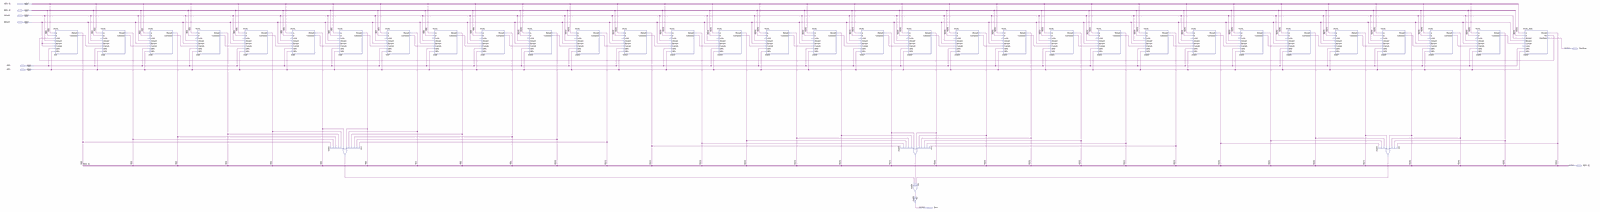
[diagram p0: schematic sheet, whole]
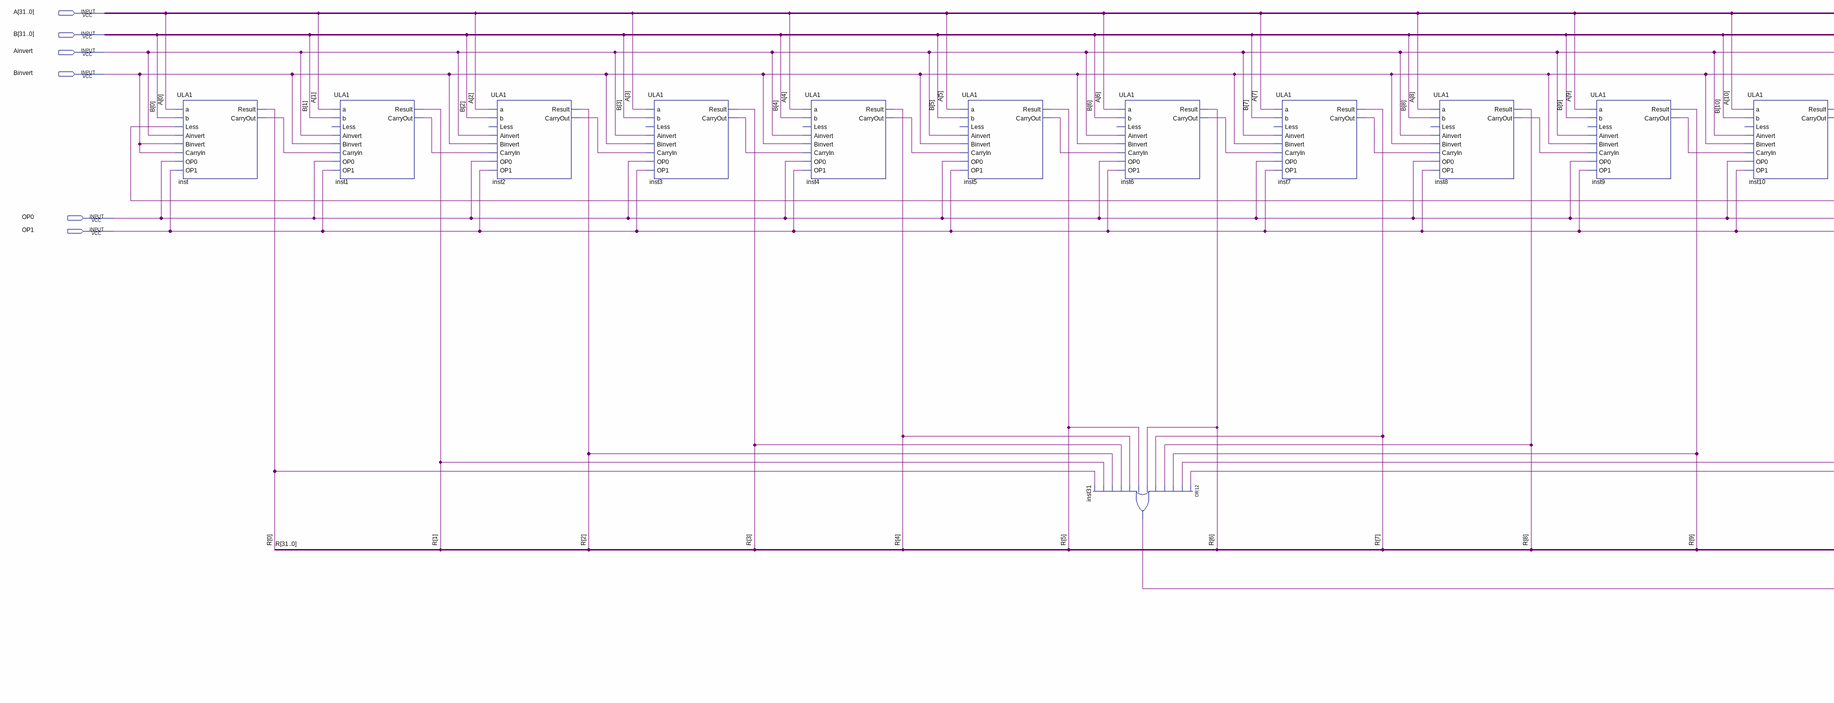
[diagram p1: schematic sheet, left part]
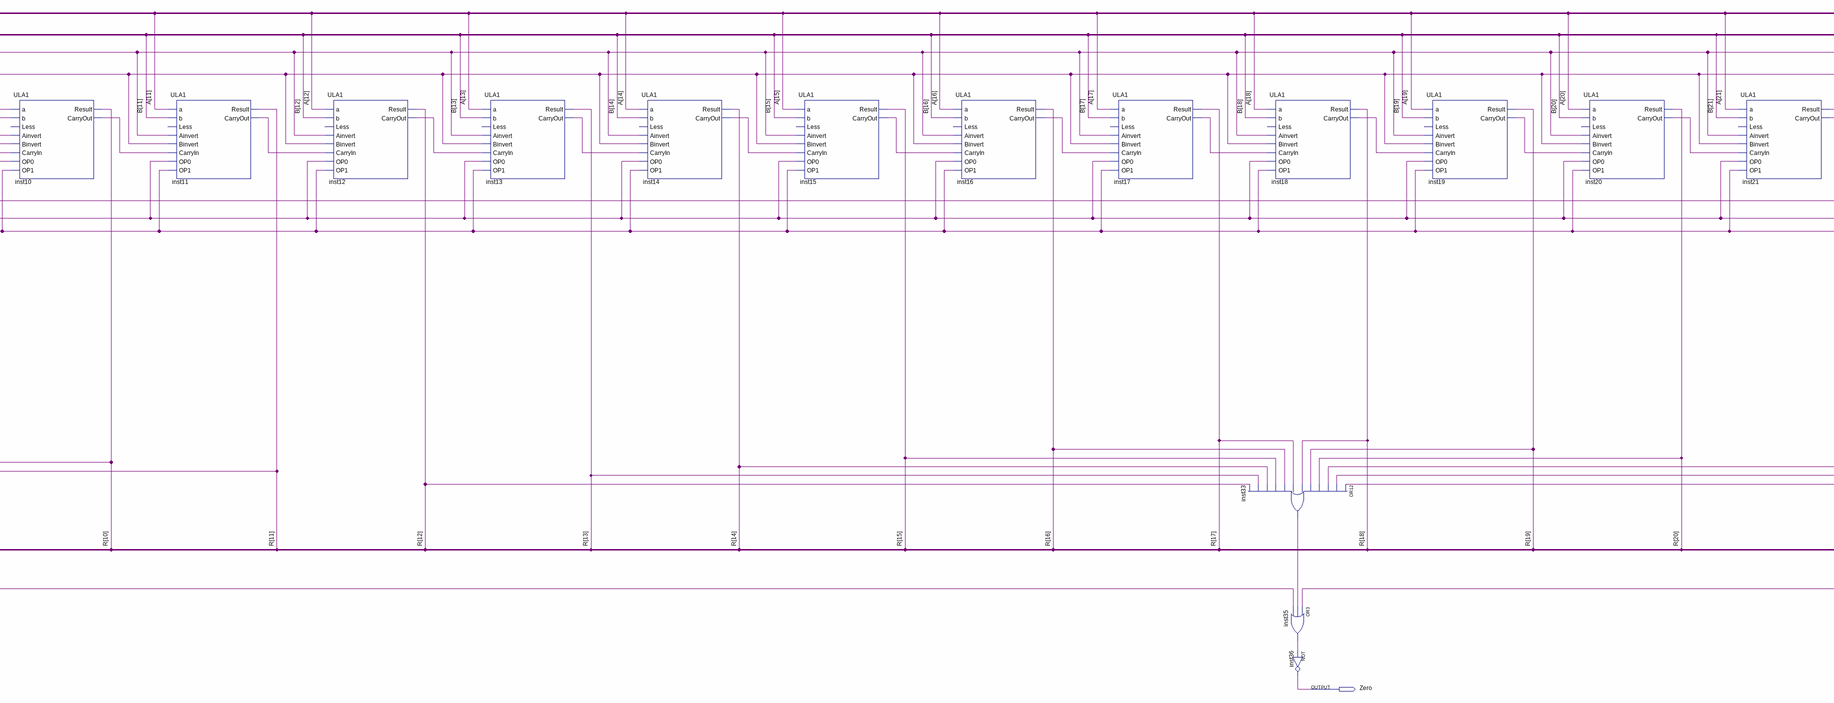
[diagram p2: schematic sheet, centre part]
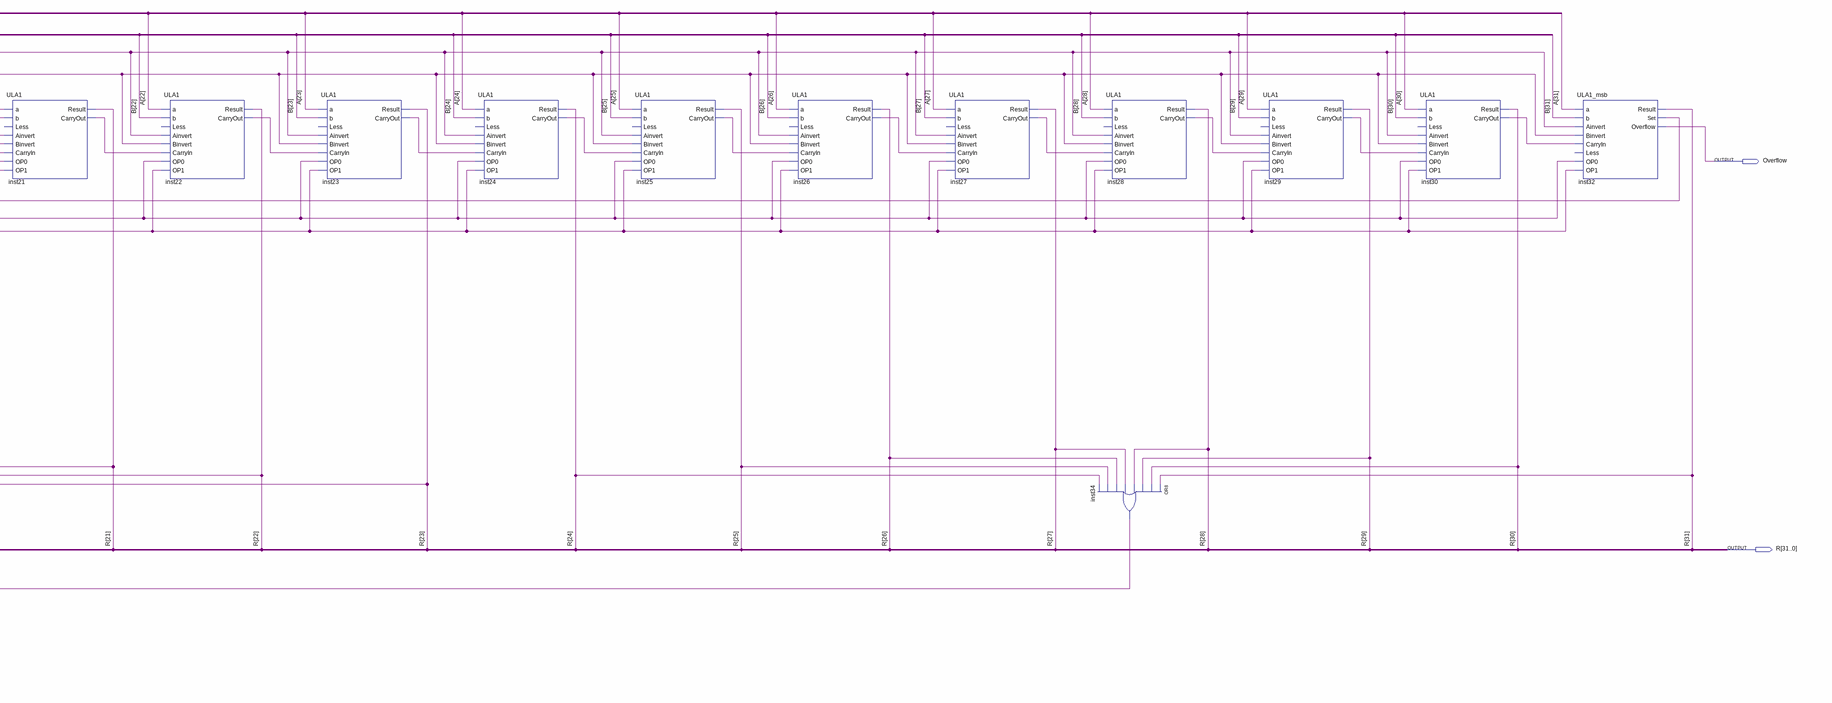
[diagram p3: schematic sheet, right part]
// Quartus schematic ULA32.bdf as structural Verilog: 37 symbols, 9 pins
module ULA32 (
  input  [31:0] A,
  input  [31:0] B,
  input  Ainvert,
  input  Binvert,
  input  OP0,
  input  OP1,
  output Overflow,
  output [31:0] R,
  output Zero
);

  wire inst1_carryout, inst2_carryout, inst3_carryout, inst4_carryout, inst5_carryout, inst6_carryout,
       inst7_carryout, inst8_carryout, inst9_carryout, inst10_carryout, inst11_carryout, inst12_carryout,
       inst13_carryout, inst14_carryout, inst15_carryout, inst16_carryout, inst17_carryout, inst18_carryout,
       inst19_carryout, inst20_carryout, inst21_carryout, inst22_carryout, inst23_carryout, inst24_carryout,
       inst25_carryout, inst26_carryout, inst27_carryout, inst28_carryout, inst29_carryout, inst30_carryout,
       inst31_out, inst32_set, inst33_out, inst34_out, inst35_out, inst_carryout;

  ULA1 inst (
    .a(A[0]), .b(B[0]), .Less(inst32_set), .Ainvert(Ainvert), .Binvert(Binvert), .CarryIn(Binvert),
    .OP0(OP0), .OP1(OP1), .Result(R[0]), .CarryOut(inst_carryout));
  ULA1 inst1 (
    .a(A[1]), .b(B[1]), .Ainvert(Ainvert), .Binvert(Binvert), .CarryIn(inst_carryout), .OP0(OP0), .OP1(OP1),
    .Result(R[1]), .CarryOut(inst1_carryout));  // open: Less
  ULA1 inst2 (
    .a(A[2]), .b(B[2]), .Ainvert(Ainvert), .Binvert(Binvert), .CarryIn(inst1_carryout), .OP0(OP0), .OP1(OP1),
    .Result(R[2]), .CarryOut(inst2_carryout));  // open: Less
  ULA1 inst3 (
    .a(A[3]), .b(B[3]), .Ainvert(Ainvert), .Binvert(Binvert), .CarryIn(inst2_carryout), .OP0(OP0), .OP1(OP1),
    .Result(R[3]), .CarryOut(inst3_carryout));  // open: Less
  ULA1 inst4 (
    .a(A[4]), .b(B[4]), .Ainvert(Ainvert), .Binvert(Binvert), .CarryIn(inst3_carryout), .OP0(OP0), .OP1(OP1),
    .Result(R[4]), .CarryOut(inst4_carryout));  // open: Less
  ULA1 inst5 (
    .a(A[5]), .b(B[5]), .Ainvert(Ainvert), .Binvert(Binvert), .CarryIn(inst4_carryout), .OP0(OP0), .OP1(OP1),
    .Result(R[5]), .CarryOut(inst5_carryout));  // open: Less
  or inst31 (inst31_out, R[11], R[10], R[9], R[8], R[7], R[6], R[5], R[4], R[3], R[2], R[1], R[0]);
  ULA1 inst6 (
    .a(A[6]), .b(B[6]), .Ainvert(Ainvert), .Binvert(Binvert), .CarryIn(inst5_carryout), .OP0(OP0), .OP1(OP1),
    .Result(R[6]), .CarryOut(inst6_carryout));  // open: Less
  ULA1 inst7 (
    .a(A[7]), .b(B[7]), .Ainvert(Ainvert), .Binvert(Binvert), .CarryIn(inst6_carryout), .OP0(OP0), .OP1(OP1),
    .Result(R[7]), .CarryOut(inst7_carryout));  // open: Less
  ULA1 inst8 (
    .a(A[8]), .b(B[8]), .Ainvert(Ainvert), .Binvert(Binvert), .CarryIn(inst7_carryout), .OP0(OP0), .OP1(OP1),
    .Result(R[8]), .CarryOut(inst8_carryout));  // open: Less
  ULA1 inst9 (
    .a(A[9]), .b(B[9]), .Ainvert(Ainvert), .Binvert(Binvert), .CarryIn(inst8_carryout), .OP0(OP0), .OP1(OP1),
    .Result(R[9]), .CarryOut(inst9_carryout));  // open: Less
  ULA1 inst10 (
    .a(A[10]), .b(B[10]), .Ainvert(Ainvert), .Binvert(Binvert), .CarryIn(inst9_carryout), .OP0(OP0),
    .OP1(OP1), .Result(R[10]), .CarryOut(inst10_carryout));  // open: Less
  ULA1 inst11 (
    .a(A[11]), .b(B[11]), .Ainvert(Ainvert), .Binvert(Binvert), .CarryIn(inst10_carryout), .OP0(OP0),
    .OP1(OP1), .Result(R[11]), .CarryOut(inst11_carryout));  // open: Less
  ULA1 inst12 (
    .a(A[12]), .b(B[12]), .Ainvert(Ainvert), .Binvert(Binvert), .CarryIn(inst11_carryout), .OP0(OP0),
    .OP1(OP1), .Result(R[12]), .CarryOut(inst12_carryout));  // open: Less
  ULA1 inst13 (
    .a(A[13]), .b(B[13]), .Ainvert(Ainvert), .Binvert(Binvert), .CarryIn(inst12_carryout), .OP0(OP0),
    .OP1(OP1), .Result(R[13]), .CarryOut(inst13_carryout));  // open: Less
  ULA1 inst14 (
    .a(A[14]), .b(B[14]), .Ainvert(Ainvert), .Binvert(Binvert), .CarryIn(inst13_carryout), .OP0(OP0),
    .OP1(OP1), .Result(R[14]), .CarryOut(inst14_carryout));  // open: Less
  ULA1 inst15 (
    .a(A[15]), .b(B[15]), .Ainvert(Ainvert), .Binvert(Binvert), .CarryIn(inst14_carryout), .OP0(OP0),
    .OP1(OP1), .Result(R[15]), .CarryOut(inst15_carryout));  // open: Less
  ULA1 inst16 (
    .a(A[16]), .b(B[16]), .Ainvert(Ainvert), .Binvert(Binvert), .CarryIn(inst15_carryout), .OP0(OP0),
    .OP1(OP1), .Result(R[16]), .CarryOut(inst16_carryout));  // open: Less
  ULA1 inst17 (
    .a(A[17]), .b(B[17]), .Ainvert(Ainvert), .Binvert(Binvert), .CarryIn(inst16_carryout), .OP0(OP0),
    .OP1(OP1), .Result(R[17]), .CarryOut(inst17_carryout));  // open: Less
  or inst33 (inst33_out, R[23], R[22], R[21], R[20], R[19], R[18], R[17], R[16], R[15], R[14], R[13], R[12]);
  ULA1 inst18 (
    .a(A[18]), .b(B[18]), .Ainvert(Ainvert), .Binvert(Binvert), .CarryIn(inst17_carryout), .OP0(OP0),
    .OP1(OP1), .Result(R[18]), .CarryOut(inst18_carryout));  // open: Less
  or inst35 (inst35_out, inst34_out, inst33_out, inst31_out);
  not inst36 (Zero, inst35_out);
  ULA1 inst19 (
    .a(A[19]), .b(B[19]), .Ainvert(Ainvert), .Binvert(Binvert), .CarryIn(inst18_carryout), .OP0(OP0),
    .OP1(OP1), .Result(R[19]), .CarryOut(inst19_carryout));  // open: Less
  ULA1 inst20 (
    .a(A[20]), .b(B[20]), .Ainvert(Ainvert), .Binvert(Binvert), .CarryIn(inst19_carryout), .OP0(OP0),
    .OP1(OP1), .Result(R[20]), .CarryOut(inst20_carryout));  // open: Less
  ULA1 inst21 (
    .a(A[21]), .b(B[21]), .Ainvert(Ainvert), .Binvert(Binvert), .CarryIn(inst20_carryout), .OP0(OP0),
    .OP1(OP1), .Result(R[21]), .CarryOut(inst21_carryout));  // open: Less
  ULA1 inst22 (
    .a(A[22]), .b(B[22]), .Ainvert(Ainvert), .Binvert(Binvert), .CarryIn(inst21_carryout), .OP0(OP0),
    .OP1(OP1), .Result(R[22]), .CarryOut(inst22_carryout));  // open: Less
  ULA1 inst23 (
    .a(A[23]), .b(B[23]), .Ainvert(Ainvert), .Binvert(Binvert), .CarryIn(inst22_carryout), .OP0(OP0),
    .OP1(OP1), .Result(R[23]), .CarryOut(inst23_carryout));  // open: Less
  ULA1 inst24 (
    .a(A[24]), .b(B[24]), .Ainvert(Ainvert), .Binvert(Binvert), .CarryIn(inst23_carryout), .OP0(OP0),
    .OP1(OP1), .Result(R[24]), .CarryOut(inst24_carryout));  // open: Less
  ULA1 inst25 (
    .a(A[25]), .b(B[25]), .Ainvert(Ainvert), .Binvert(Binvert), .CarryIn(inst24_carryout), .OP0(OP0),
    .OP1(OP1), .Result(R[25]), .CarryOut(inst25_carryout));  // open: Less
  ULA1 inst26 (
    .a(A[26]), .b(B[26]), .Ainvert(Ainvert), .Binvert(Binvert), .CarryIn(inst25_carryout), .OP0(OP0),
    .OP1(OP1), .Result(R[26]), .CarryOut(inst26_carryout));  // open: Less
  ULA1 inst27 (
    .a(A[27]), .b(B[27]), .Ainvert(Ainvert), .Binvert(Binvert), .CarryIn(inst26_carryout), .OP0(OP0),
    .OP1(OP1), .Result(R[27]), .CarryOut(inst27_carryout));  // open: Less
  ULA1 inst28 (
    .a(A[28]), .b(B[28]), .Ainvert(Ainvert), .Binvert(Binvert), .CarryIn(inst27_carryout), .OP0(OP0),
    .OP1(OP1), .Result(R[28]), .CarryOut(inst28_carryout));  // open: Less
  or inst34 (inst34_out, R[31], R[30], R[29], R[28], R[27], R[26], R[25], R[24]);
  ULA1 inst29 (
    .a(A[29]), .b(B[29]), .Ainvert(Ainvert), .Binvert(Binvert), .CarryIn(inst28_carryout), .OP0(OP0),
    .OP1(OP1), .Result(R[29]), .CarryOut(inst29_carryout));  // open: Less
  ULA1 inst30 (
    .a(A[30]), .b(B[30]), .Ainvert(Ainvert), .Binvert(Binvert), .CarryIn(inst29_carryout), .OP0(OP0),
    .OP1(OP1), .Result(R[30]), .CarryOut(inst30_carryout));  // open: Less
  ULA1_msb inst32 (
    .a(A[31]), .b(B[31]), .Ainvert(Ainvert), .Binvert(Binvert), .CarryIn(inst30_carryout), .OP0(OP0),
    .OP1(OP1), .Result(R[31]), .Set(inst32_set), .Overflow(Overflow));  // open: Less
endmodule
